# Altium schematic sheet Sheet2.SchDoc
size A4; SheetNumber: 2; SheetTotal: 2
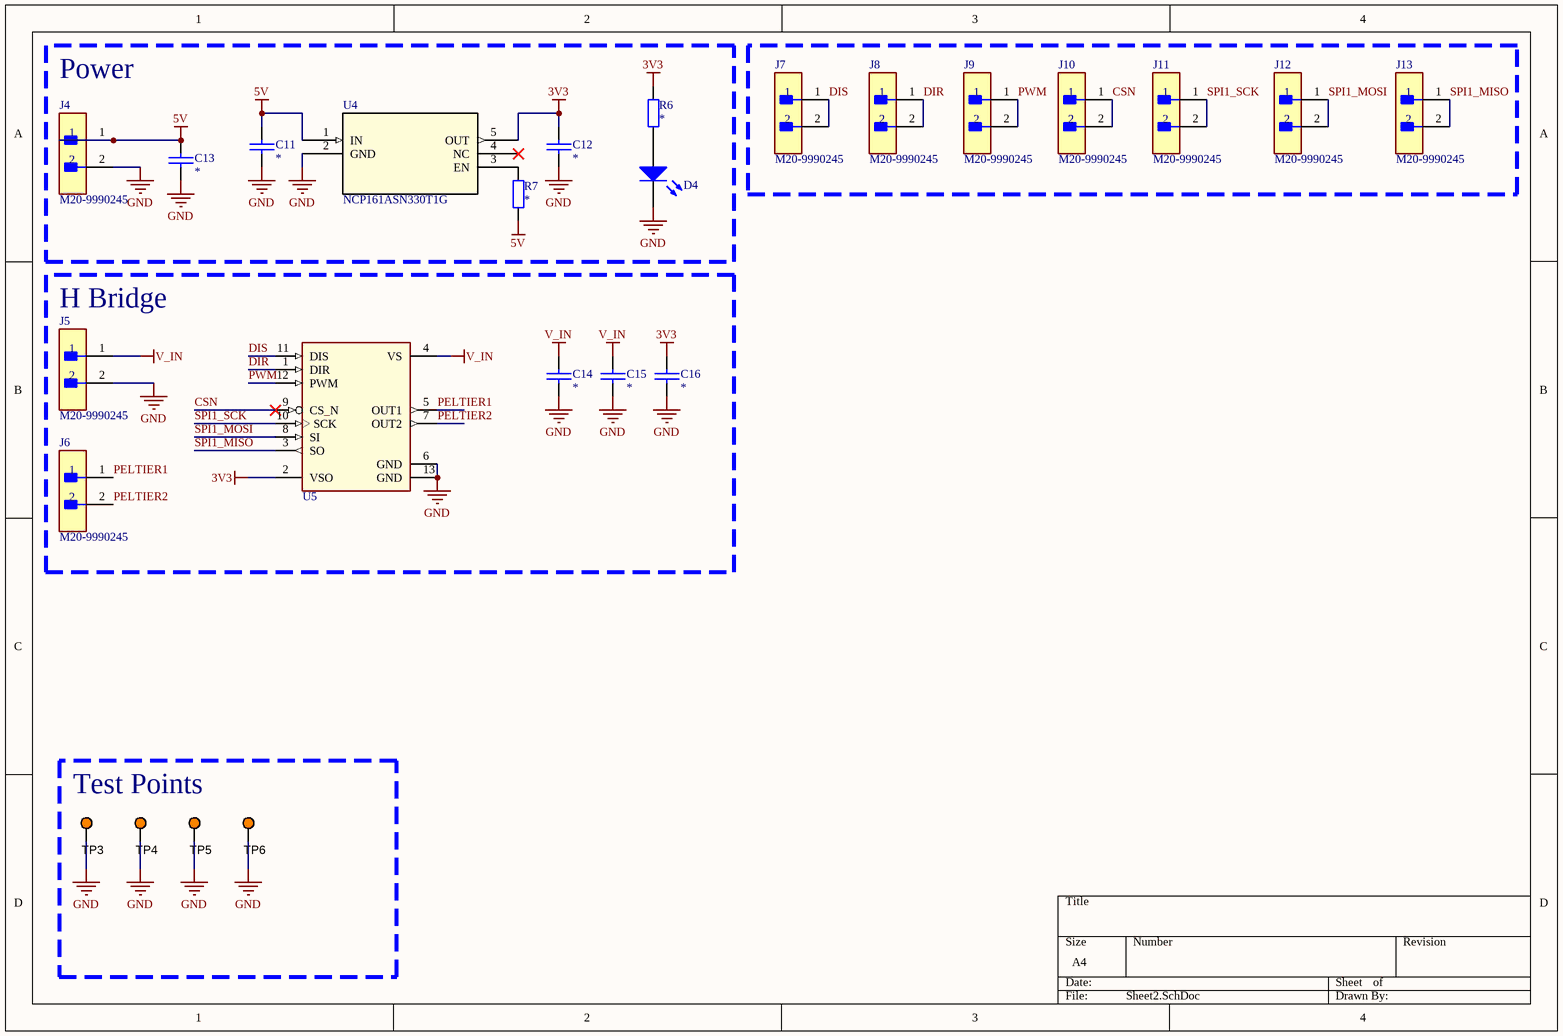
[diagram p0: Sheet2.SchDoc]

## Parts
C11  *  [0805 CAP]
C12  *  [0805 CAP]
C13  *  [0805 CAP]
C14  *  [0805 CAP]
C15  *  [0805 CAP]
C16  *  [0805 CAP]
D4  LTST-C170KGKT  [0805 LED]  (value not drawn)
J4  M20-9990245  [FP-M20-9990245-MFG]
J5  M20-9990245  [FP-M20-9990245-MFG]
J6  M20-9990245  [FP-M20-9990245-MFG]
J7  M20-9990245  [FP-M20-9990245-MFG]
J8  M20-9990245  [FP-M20-9990245-MFG]
J9  M20-9990245  [FP-M20-9990245-MFG]
J10  M20-9990245  [FP-M20-9990245-MFG]
J11  M20-9990245  [FP-M20-9990245-MFG]
J12  M20-9990245  [FP-M20-9990245-MFG]
J13  M20-9990245  [FP-M20-9990245-MFG]
R6  *  [0805 RES]
R7  *  [0805 RES]
TP3  5003  [TP_TH]  (value not drawn)
TP4  5003  [TP_TH]  (value not drawn)
TP5  5003  [TP_TH]  (value not drawn)
TP6  5003  [TP_TH]  (value not drawn)
U4  NCP161ASN330T1G  [SOT23_527AH_ONS]
U5  IFX9201SG  [SOP100P1030X260-13N]  (value not drawn)

## Blocks framed on the sheet
Power: C11-C13 D4 J4 R6 R7 U4
H Bridge: C14-C16 J5 J6 U5
Test Points: TP3-TP6

## Nets
3V3: C12.1 C16.1 R6.1 U4.5(OUT) U5.2(VSO)
5V: C11.1 C13.1 J4.1 R7.2 U4.1(IN)
GND: C11.2 C12.2 C13.2 C14.2 C15.2 C16.2 D4.2(K) J4.2 J5.2 TP3.1 TP4.1 TP5.1 TP6.1 U4.2(GND) U5.6(GND) U5.13(GND)
V_IN: C14.1 C15.1 J5.1 U5.4(VS)
CSN: J10.1 J10.2 U5.9(CS_N)
DIR: J8.1 J8.2 U5.1(DIR)
DIS: J7.1 J7.2 U5.11(DIS)
PELTIER1: J6.1 U5.5(OUT1)
PELTIER2: J6.2 U5.7(OUT2)
PWM: J9.1 J9.2 U5.12(PWM)
SPI1_MISO: J13.1 J13.2 U5.3(SO)
SPI1_MOSI: J12.1 J12.2 U5.8(SI)
SPI1_SCK: J11.1 J11.2 U5.10(SCK)
NetD4_1: D4.1(A) R6.2
NetR7_1: R7.1 U4.3(EN)

Not connected (* = marked no-connect by the designer): U4 4(NC)*

## Library data of the parts
C11-C16 = CerCap_SMT_0805: SMT ceramic capacitor 0805 size; Value: *
D4 = LED_SMT_0805: SMT LED 0805 size; Manufacturer: Lite-On Inc.; Color: Green; Lens Color: Colorless; Lens Transparency: Clear; Millicandela Rating: 35mcd; Lens Style/Size: Rectangle with Flat Top, 1.40mm x 1.25mm; Voltage - Forward (Vf) (Typ): 2V; Current - Test: 20mA; Viewing Angle: 130°; Wavelength - Dominant: 571nm; Wavelength - Peak: 574nm; Supplier 1: Digi-Key; Manufacturer Part Number: LTST-C170KGKT; RoHS: RoHS Compliant; Category: Optoelectronics; Stock 1: 503069; Pricing 1: 1=0.62, 10=0.459, 25=0.338, 100=0.2415, 250=0.16416, 500=0.14486, 1000=0.11347 (NZD); Packaging: Cut Tape (CT); Part Status: Active; Mounting Type: Surface Mount; Features: -; Package / Case: 0805 (2012 Metric); Size / Dimension: 2.00mm L x 1.25mm W; Height (Max): 1.10mm; ComponentLink1URL: http://optoelectronics.liteon.com/upload/download/DS22-2000-073/LTST-C170KGKT.pdf; ComponentLink1Description: http://optoelectronics.liteon.com/upload/download/DS22-2000-073/LTST-C170KGKT.pdf; Supplier Part Number 1: 160-1414-1-ND
J4-J13 = CMP-15831-000105-1: CONN HEADER VERT 2POS 2.54MM; Working Voltage: 750V; Gender: Male; Number of Poles: 2; Current Rating: 3A; Mated Stacking Heights: 16.54mm; Contact Resistance: 25mR; Connector Type: Male Pin; Insulation Resistance: 10GR; Mating Cycles: 300; Voltage: 50V; Flammability Rating: UL94 V-0; Pitch: 2.54mm; Series: M20; Number of Contacts: 2; Height: 0.12inch; Min Operating Temperature: -40°C; Contact Finish - Mating: GOLD; Number of Positions: 2; Number of Rows: 1; Packaging: Bulk; Package Quantity: 1000; Voltage Rating (AC): 750V; Current: 3A; Mount: Through Hole; Case/Package: SIL; Orientation: Straight; Contact Shape: Square; Weight: 0.25lb; Radiation Hardening: No; Fastening Type: Pull; Length: 5.08mm; Depth: 2.54mm; Contact Mating Length: 0.24inch; Housing Material: Nylon; Reach SVHC Compliant: Yes; Insulation Material: Nylon; Color: Black; Width: 0.25inch; Insulation Color: Black; Contact Material: Brass; Contact Type: Male Pin; Termination: Solder; Max Operating Temperature: 105°C; Contact Plating: Gold; Housing Color: Black; Max Current Rating: 3A; Lead Pitch: 2.54mm
R6 R7 = Res_SMT_0805: 0805 resistor; Published: 8-Jun-2000; LatestRevisionDate: 17-Jul-2002; LatestRevisionNote: Re-released for DXP Platform.; PackageReference: AXIAL-0.4; Publisher: Altium Limited; Value: *; ComponentLink1Description: https://nz.mouser.com/datasheet/2/315/AOA0000C304-1149620.pdf
TP3-TP6 = TestPoint: Test Point, Orange, 1-Pin THD, RoHS; Peak Reverse Current: 600 uA; Forward Current: 3 A; Max Surge Current: 80 A; Forward Voltage: 1.08 V; Max Operating Temperature: 150 degC; PackageReference: 5003; Pins: 2; ComponentLink2URL: http://keyelco.com/userAssets/file/M65p56.pdf; PackageDescription: 1-Pin Through Hole Device, Dia 2.54 mm; Weight: 0.01 lb; Diameter: 5.3 mm; Mount: Through Hole; Package Quantity: 500; Packaging: Bulk; Min Operating Temperature: -65 degC; ComponentLink1Description: Manufacturer URL; Height: 0.25 inch; ComponentLink1URL: http://www.keyelco.com/; ComponentLink2Description: Datasheet; Width: 0.25 inch; REACH SVHC: No SVHC; RoHSCompliant: true; Radiation Hardening: No; Length: 9.5 mm; DatasheetVersion: Jun-15
U4 = NCP161ASN330T1G: Description; Manufacturer_Name: onsemi; Copyright: Copyright (C) 2026 Ultra Librarian. All rights reserved.; Manufacturer_Part_Number: NCP161ASN330T1G; RefDes: RefDes; Type: Type
U5 = IFX9201SG: 6 A H-Bridge with SPI; Manufacturer: Infineon Technologies; ManufacturerPartNumber: IFX9201SG; PackageReference: PG-DSO-12-17